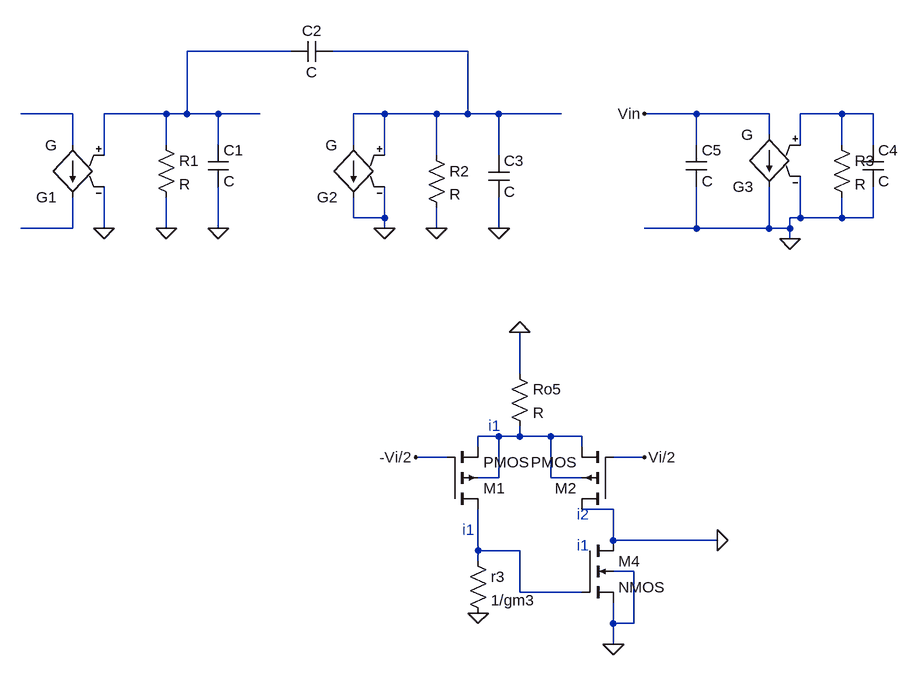
[diagram p0: schematic pequenossinais.asc]
pequenossinais.asc, the LTspice schematic file:
Version 4
SHEET 1 880 680
WIRE -1056 -768 -1216 -768
WIRE -784 -768 -992 -768
WIRE -1392 -672 -1472 -672
WIRE -1248 -672 -1344 -672
WIRE -1216 -672 -1216 -768
WIRE -1216 -672 -1248 -672
WIRE -1168 -672 -1216 -672
WIRE -1104 -672 -1168 -672
WIRE -912 -672 -960 -672
WIRE -832 -672 -912 -672
WIRE -784 -672 -784 -768
WIRE -784 -672 -832 -672
WIRE -736 -672 -784 -672
WIRE -640 -672 -736 -672
WIRE -432 -672 -512 -672
WIRE -320 -672 -432 -672
WIRE -208 -672 -272 -672
WIRE -160 -672 -208 -672
WIRE -320 -640 -320 -672
WIRE -1392 -624 -1392 -672
WIRE -1248 -624 -1248 -672
WIRE -1168 -624 -1168 -672
WIRE -960 -624 -960 -672
WIRE -432 -624 -432 -672
WIRE -272 -624 -272 -672
WIRE -208 -624 -208 -672
WIRE -160 -624 -160 -672
WIRE -1344 -608 -1344 -672
WIRE -912 -608 -912 -672
WIRE -832 -608 -832 -672
WIRE -736 -608 -736 -672
WIRE -960 -512 -960 -544
WIRE -912 -512 -912 -560
WIRE -912 -512 -960 -512
WIRE -272 -512 -272 -576
WIRE -272 -512 -288 -512
WIRE -208 -512 -208 -544
WIRE -208 -512 -272 -512
WIRE -160 -512 -160 -560
WIRE -160 -512 -208 -512
WIRE -1392 -496 -1392 -544
WIRE -1392 -496 -1472 -496
WIRE -1344 -496 -1344 -560
WIRE -1248 -496 -1248 -544
WIRE -1168 -496 -1168 -560
WIRE -912 -496 -912 -512
WIRE -832 -496 -832 -528
WIRE -736 -496 -736 -544
WIRE -432 -496 -432 -560
WIRE -432 -496 -512 -496
WIRE -320 -496 -320 -560
WIRE -320 -496 -432 -496
WIRE -288 -496 -288 -512
WIRE -288 -496 -320 -496
WIRE -288 -480 -288 -496
WIRE -704 -272 -704 -336
WIRE -736 -176 -768 -176
WIRE -704 -176 -704 -192
WIRE -704 -176 -736 -176
WIRE -656 -176 -704 -176
WIRE -608 -176 -656 -176
WIRE -768 -160 -768 -176
WIRE -608 -160 -608 -176
WIRE -816 -144 -864 -144
WIRE -512 -144 -560 -144
WIRE -736 -112 -736 -176
WIRE -736 -112 -768 -112
WIRE -656 -112 -656 -176
WIRE -608 -112 -656 -112
WIRE -560 -64 -608 -64
WIRE -560 -16 -560 -64
WIRE -400 -16 -560 -16
WIRE -768 0 -768 -64
WIRE -704 0 -768 0
WIRE -768 16 -768 0
WIRE -528 32 -560 32
WIRE -704 64 -704 0
WIRE -608 64 -704 64
WIRE -560 112 -560 80
WIRE -528 112 -528 32
WIRE -528 112 -560 112
WIRE -560 144 -560 112
FLAG -912 -496 0
FLAG -1168 -496 0
FLAG -1248 -496 0
FLAG -1344 -496 0
FLAG -832 -496 0
FLAG -736 -496 0
FLAG -288 -480 0
FLAG -512 -672 Vin
FLAG -704 -336 0
FLAG -560 144 0
FLAG -768 96 0
FLAG -400 -16 0
FLAG -512 -144 Vi/2
FLAG -864 -144 -Vi/2
SYMBOL res -1264 -640 R0
SYMATTR InstName R1
SYMBOL cap -1184 -624 R0
SYMATTR InstName C1
SYMBOL cap -992 -784 R90
WINDOW 0 0 32 VBottom 2
WINDOW 3 32 32 VTop 2
SYMATTR InstName C2
SYMBOL res -848 -624 R0
SYMATTR InstName R2
SYMBOL cap -752 -608 R0
SYMATTR InstName C3
SYMBOL g2 -1392 -528 R180
SYMATTR InstName G1
SYMBOL g2 -960 -528 R180
SYMATTR InstName G2
SYMBOL cap -176 -624 R0
SYMATTR InstName C4
SYMBOL res -224 -640 R0
SYMATTR InstName R3
SYMBOL g2 -320 -544 R180
SYMATTR InstName G3
SYMBOL cap -448 -624 R0
SYMATTR InstName C5
SYMBOL res -720 -288 R0
SYMATTR InstName Ro5
SYMBOL pmos4 -816 -64 M180
SYMATTR InstName M1
SYMBOL pmos4 -560 -64 R180
SYMATTR InstName M2
SYMBOL res -784 0 R0
SYMATTR InstName r3
SYMATTR Value 1/gm3
SYMBOL nmos4 -608 -16 R0
SYMATTR InstName M4
TEXT -752 -192 Left 2 ;i1
TEXT -792 -32 Left 2 ;i1
TEXT -616 -8 Left 2 ;i1
TEXT -616 -56 Left 2 ;i2

The netlist it stands for:
* pequenossinais.asc
R1 N001 0 R
C1 N001 0 C
C2 N002 N001 C
R2 N002 0 R
C3 N002 0 C
G1 N003 N005 N001 0 G
G2 N002 0 N002 0 G
C4 N004 0 C
R3 N004 0 R
G3 Vin 0 N004 0 G
C5 Vin 0 C
Ro5 0 N006 R
M1 N007 -Vi/2 N006 N006 PMOS
M2 0 Vi/2 N006 N006 PMOS
r3 N007 0 1/gm3
M4 0 N007 0 0 NMOS
.model NMOS NMOS
.model PMOS PMOS
.lib standard.mos
* i1
* i1
* i1
* i2
.backanno
.end